# EAGLE design SparkFun_TransmogriShield (EAGLE 7.2.0)
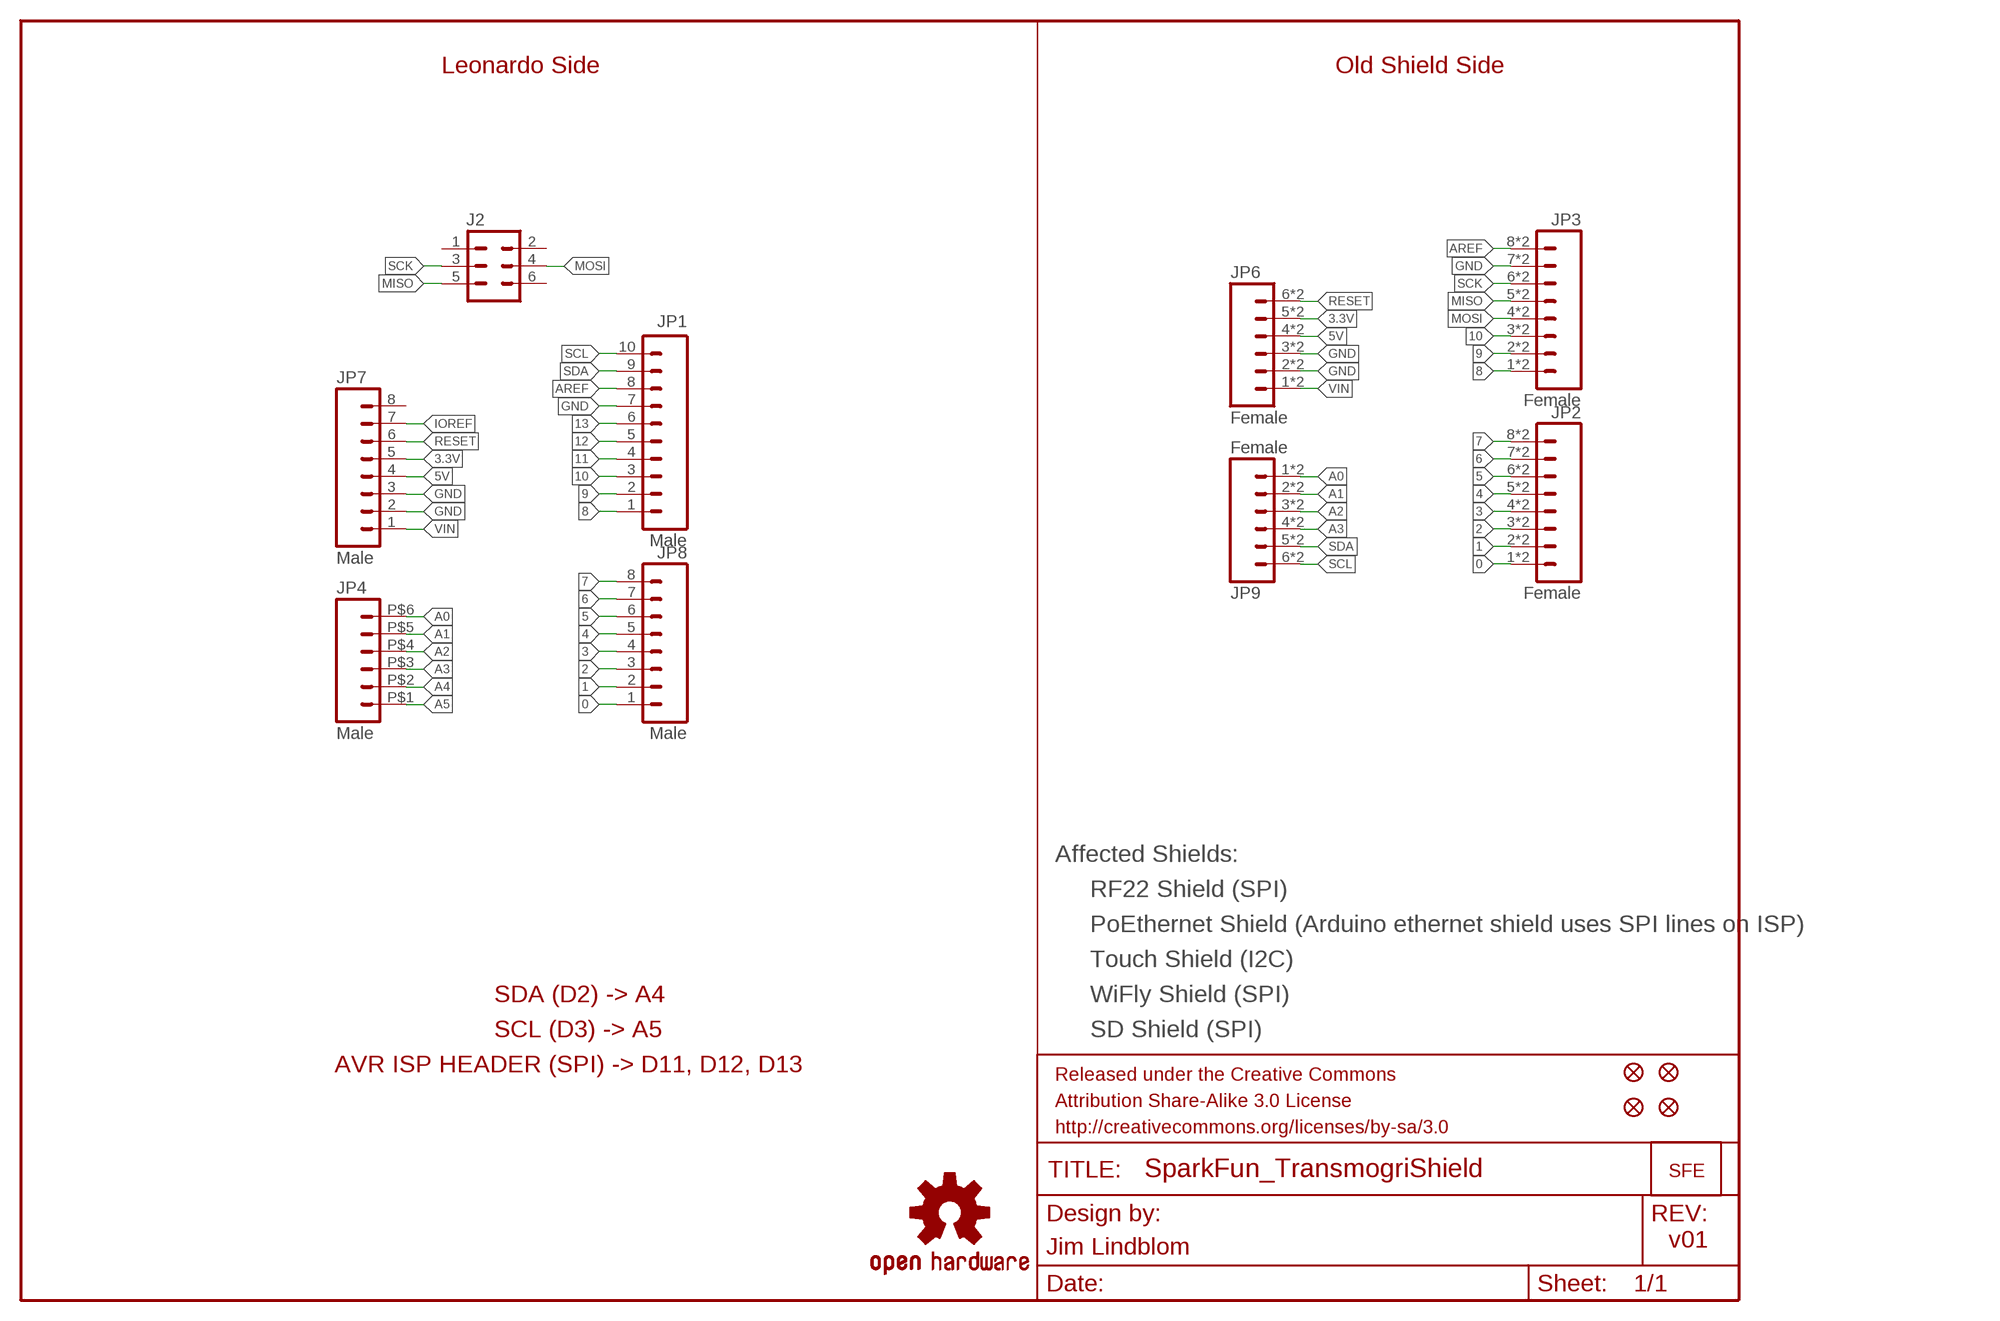
[diagram p0: schematic, sheet 1]

## Parts
J2  Female  M03X2  [2X3_SMD]
JP1  Male  M10SMD_MALE  [1X10_SMD_MALE]
JP2  Female  M08SMD-COMBO  [1X08_SMD_COMBINED]
JP3  Female  M08SMD-COMBO  [1X08_SMD_COMBINED]
JP4  Male  M06SMD_MALE  [1X06_SMD_MALE]
JP6  Female  M06SMD-STRAIGHT-COMBO  [1X06_SMD_STRAIGHT_COMBO]
JP7  Male  M08SMD-MALE  [1X08_SMD_MALE]
JP8  Male  M08SMD-MALE  [1X08_SMD_MALE]
JP9  Female  M06SMD-STRAIGHT-COMBO  [1X06_SMD_STRAIGHT_COMBO]
JP10  LOGO-SFESK  [SFE-LOGO-FLAME]
JP11  FIDUCIALUFIDUCIAL  [MICRO-FIDUCIAL]
JP12  FIDUCIALUFIDUCIAL  [MICRO-FIDUCIAL]
JP13  FIDUCIALUFIDUCIAL  [MICRO-FIDUCIAL]
JP14  FIDUCIALUFIDUCIAL  [MICRO-FIDUCIAL]
U$1  OSHW-LOGOS  [OSHW-LOGO-S]

## Nets
0: JP2.1 JP2.1@2 JP8.1
1: JP2.2 JP2.2@2 JP8.2
2: JP2.3 JP2.3@2 JP8.3
3: JP2.4 JP2.4@2 JP8.4
3.3V: JP6.5 JP6.5-2 JP7.5
4: JP2.5 JP2.5@2 JP8.5
5: JP2.6 JP2.6@2 JP8.6
5V: JP6.4 JP6.4-2 JP7.4
6: JP2.7 JP2.7@2 JP8.7
7: JP2.8 JP2.8@2 JP8.8
8: JP1.1 JP3.1 JP3.1@2
9: JP1.2 JP3.2 JP3.2@2
10: JP1.3 JP3.3 JP3.3@2
11: JP1.4
12: JP1.5
13: JP1.6
A0: JP4.P$6 JP9.1 JP9.1-2
A1: JP4.P$5 JP9.2 JP9.2-2
A2: JP4.P$4 JP9.3 JP9.3-2
A3: JP4.P$3 JP9.4 JP9.4-2
A4: JP4.P$2
A5: JP4.P$1
AREF: JP1.8 JP3.8 JP3.8@2
GND: JP1.7 JP3.7 JP3.7@2 JP6.2 JP6.2-2 JP6.3 JP6.3-2 JP7.2 JP7.3
IOREF: JP7.7
MISO: J2.5 JP3.5 JP3.5@2
MOSI: J2.4 JP3.4 JP3.4@2
RESET: JP6.6 JP6.6-2 JP7.6
SCK: J2.3 JP3.6 JP3.6@2
SCL: JP1.10 JP9.6 JP9.6-2
SDA: JP1.9 JP9.5 JP9.5-2
VIN: JP6.1 JP6.1-2 JP7.1
Unconnected: J2.1 J2.2 J2.6 JP7.8

## Notes on the sheet
- Leonardo Side | Old Shield Side
- Affected Shields:
- RF22 Shield (SPI)
- PoEthernet Shield (Arduino ethernet shield uses SPI lines on ISP)
- Touch Shield (I2C)
- SDA (D2) -> A4 | WiFly Shield (SPI)
- SCL (D3) -> A5 | SD Shield (SPI)
- AVR ISP HEADER (SPI) -> D11, D12, D13
- v01
- Jim Lindblom

## Library data of the parts
J2 = SparkFun-Connectors:M03X2
JP1 = SparkFun-Connectors:M10: Header 10 Standard 10-pin 0.1" header. Use with straight break away headers (SKU : PRT-00116), right angle break away headers (PRT-00553), swiss pins (PRT-00743), machine pins (PRT-00117), and female headers (PRT-00115).
JP2 JP3 JP7 JP8 = SparkFun-Connectors:M08: Header 8 Standard 8-pin 0.1" header. Use with straight break away headers (SKU : PRT-00116), right angle break away headers (PRT-00553), swiss pins (PRT-00743), machine pins (PRT-00117), and female headers (PRT-00115).
JP4 JP6 JP9 = SparkFun-Connectors:M06: Header 6 Standard 6-pin 0.1" header. Use with straight break away headers (SKU : PRT-00116), right angle break away headers (PRT-00553), swiss pins (PRT-00743), machine pins (PRT-00117), and female headers (PRT-00115). Molex polarized connector foot print use with SKU : PRT-08094 with associated crimp pins and housings. NOTES ON THE VARIANTS LOCK and LOCK_LONGPADS... This footprint was designed to help hold the alignment of a through-hole component (i.e. 6-pin header) while soldering it into place. You may notice that each hole has been shifted either up or down by 0.005 of an inch from it's more standard position (which is a perfectly straight line). This slight alteration caused the pins (the squares in the middle) to touch the edges of the holes. Because they are alternating, it causes a "brace" to hold the component in place. 0.005 has proven to be the perfect amount of "off-center" position when using our standard breakaway headers. Although looks a little odd when you look at the bare footprint, once you have a header in there, the alteration is very hard to notice. Also, if you push a header all the way into place, it is covered up entirely on the bottom side. This idea of altering the position of holes to aid alignment will be further integrated into the Sparkfun Library for other footprints. It can help hold any component with 3 or more connection pins.
JP10 = SparkFun-Aesthetics:LOGO-SFE: Spark Fun Electronics PCB Logo This is the standard Spark Fun Electronics PCB logo.
JP11-JP14 = SparkFun:FIDUCIAL: Fiducial Alignment Points Various fiducial points for machine vision alignment.
U$1 = SparkFun-Aesthetics:OSHW-LOGO: Open Source Hardware Logo This logo indicates the piece of hardware it is found on incorporates a OSHW license and/or adheres to the definition of open source hardware found here: http://freedomdefined.org/OSHW

## Board
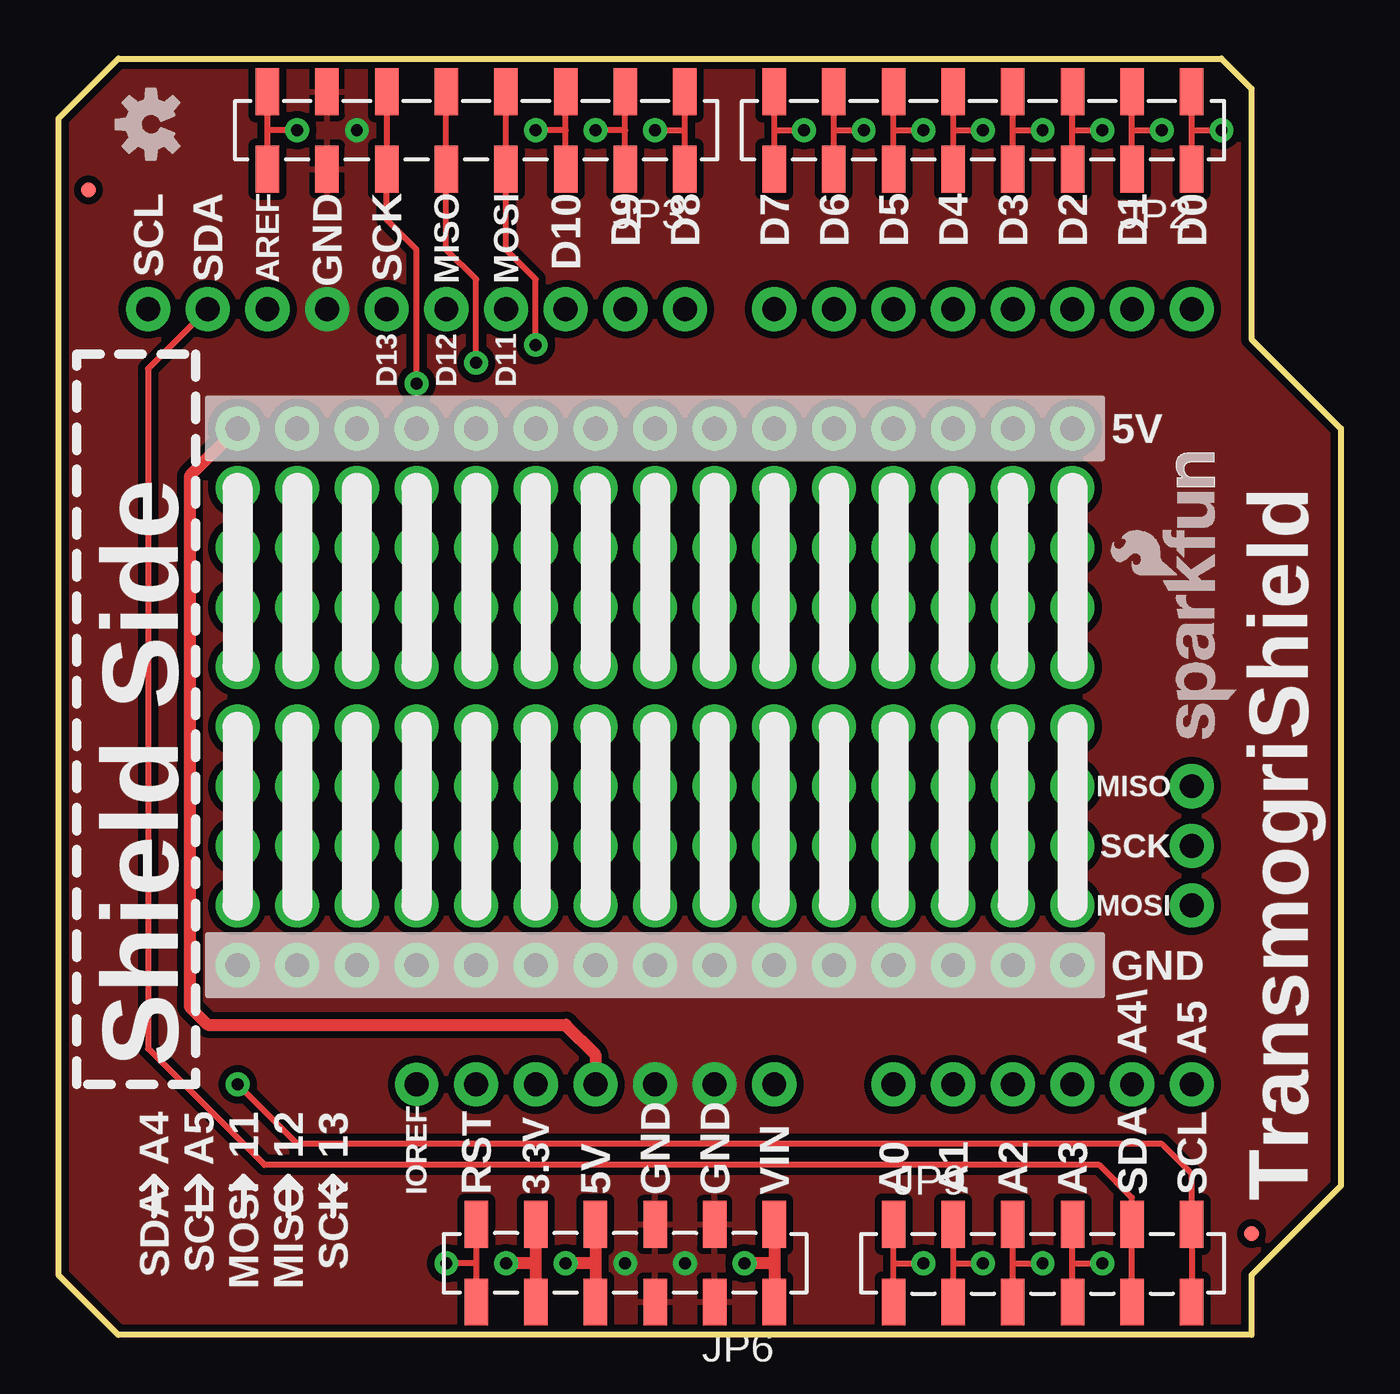
[diagram p1: board, top side]
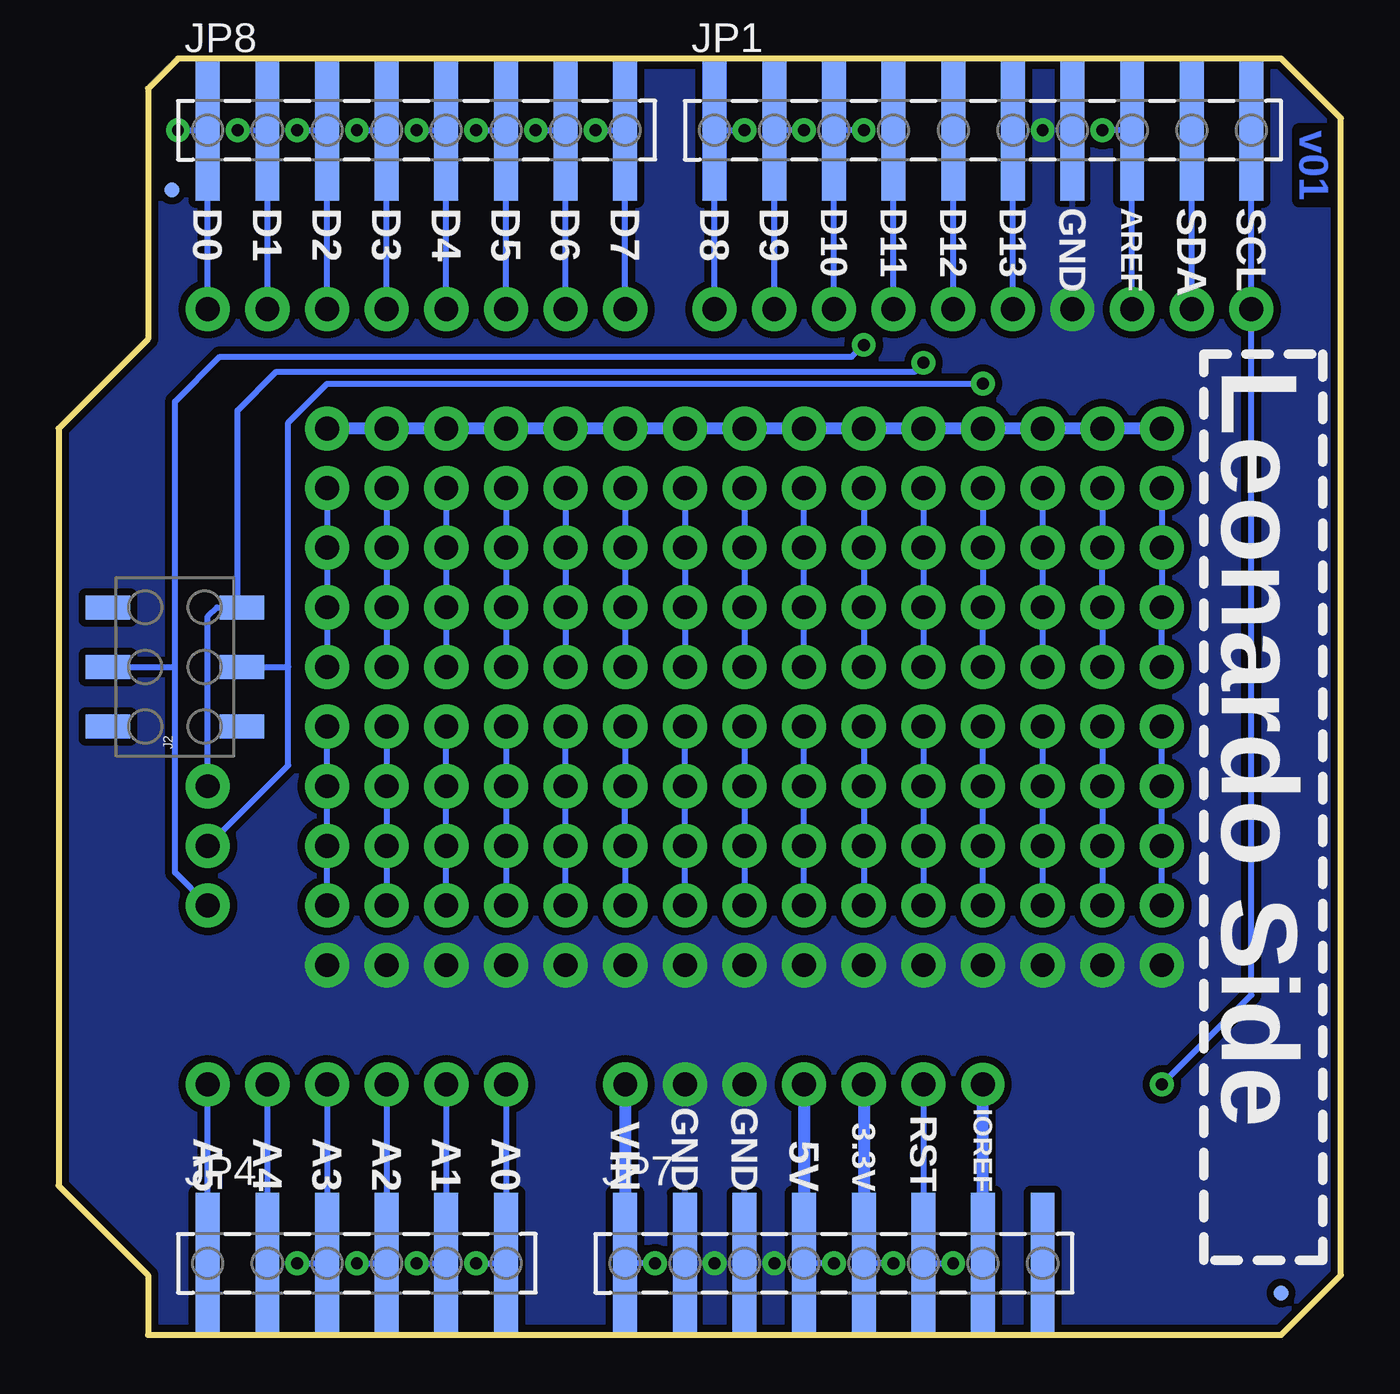
[diagram p2: board, bottom side, seen from below]

Size 54.61 x 54.36 mm. Coordinates in mm from the lower left corner, seen from the top.
Outline: 2.54,0 0,2.54 0,51.82 2.54,54.36 49.53,54.36 50.8,53.09 50.8,42.42 54.61,38.61 54.61,6.35 50.8,2.54 50.8,0 2.54,0
Copper layers (1*16): Top 0.035mm / dielectric 1.5mm / Bottom 0.035mm
Design rules "default": minimum track width 8mil, minimum drill 20mil, track to track 8mil, track to pad 8mil, pad to pad 8mil, via to via 8mil, smd to smd 8mil, copper to edge 8mil, drill to drill 8mil, minimum pad ring 12mil, minimum via ring 10mil, stop-mask expansion 4mil, vias tented up to drill 20mil, thermal gap 10mil

### Footprints (pad centres in the part's own frame; a part is rotated, then mirrored left to right if it is on the bottom)
2X3_SMD = smd 1.02 x 1.9: 1 -2.54,-2.85; 2 -2.54,2.85; 3 0,-2.85; 4 0,2.85; 5 2.54,-2.85; 6 2.54,2.85
1X10_SMD_MALE = smd 1.02 x 6: 1 0,0; 2 2.54,0; 3 5.08,0; 4 7.62,0; 5 10.16,0; 6 12.7,0; 7 15.24,0; 8 17.78,0; 9 20.32,0; 10 22.86,0
1X08_SMD_COMBINED = smd 1 x 2: 1 0,1.65; 1@2 0,-1.65; 2 2.54,-1.65; 2@2 2.54,1.65; 3 5.08,1.65; 3@2 5.08,-1.65; 4 7.62,-1.65; 4@2 7.62,1.65; 5 10.16,1.65; 5@2 10.16,-1.65; 6 12.7,-1.65; 6@2 12.7,1.65; 7 15.24,1.65; 7@2 15.24,-1.65; 8 17.78,-1.65; 8@2 17.78,1.65
1X06_SMD_MALE = smd 1.02 x 6: P$1 0,0; P$2 2.54,0; P$3 5.08,0; P$4 7.62,0; P$5 10.16,0; P$6 12.7,0
1X06_SMD_STRAIGHT_COMBO = smd 1 x 2: 1 0,-1.65; 1-2 0,1.65; 2 2.54,1.65; 2-2 2.54,-1.65; 3 5.08,-1.65; 3-2 5.08,1.65; 4 7.62,1.65; 4-2 7.62,-1.65; 5 10.16,-1.65; 5-2 10.16,1.65; 6 12.7,1.65; 6-2 12.7,-1.65
1X08_SMD_MALE = smd 1.02 x 6: 1 0,0; 2 2.54,0; 3 5.08,0; 4 7.62,0; 5 10.16,0; 6 12.7,0; 7 15.24,0; 8 17.78,0
MICRO-FIDUCIAL = smd 0.635 x 0.635: 1 0,0

### Placement (x,y rotation side)
J2  49.66,28.45 90 bottom
JP1  26.67,51.31 0 bottom
JP2  48.26,51.31 180 top
JP3  26.67,51.31 180 top
JP4  48.26,3.05 0 bottom
JP5  LOGO-SFENW2  [SFE-NEW-WEB]  50.16,25.4 90 top
JP6  30.48,3.05 180 top
JP7  30.48,3.05 0 bottom
JP8  48.26,51.31 0 bottom
JP9  35.56,3.05 0 top
JP10  47.62,32.38 90 top
JP11  50.8,4.32 0 top
JP12  1.27,48.77 0 top
JP13  2.54,1.78 0 bottom
JP14  49.78,48.77 0 bottom
U$1  3.94,51.56 90 top

### Tracks (layer width: path | path; a pad name or v marks a point on that pad's centre or on a via)
0  (via drill 0.51, 1.02 pad 1.88)
  Top 0.254: JP2.1 JP8.1 | JP8.1 JP2.1@2 | JP8.1 v49.53,51.31
  Bottom 0.254: v48.26,43.69 JP8.1 v49.53,51.31
1  (via drill 0.51, 1.02 pad 1.88)
  Top 0.254: JP2.2@2 JP8.2 | JP8.2 JP2.2 | JP8.2 v46.99,51.31
  Bottom 0.254: v45.72,43.69 JP8.2 v46.99,51.31
2  (via drill 0.51, 1.02 pad 1.88)
  Top 0.254: JP2.3 JP8.3 | JP8.3 JP2.3@2 | JP8.3 v44.45,51.31
  Bottom 0.254: v43.18,43.69 JP8.3 v44.45,51.31
3  (via drill 0.51, 1.02 pad 1.88)
  Top 0.254: JP2.4@2 JP8.4 | JP8.4 JP2.4 | JP8.4 v41.91,51.31
  Bottom 0.254: v40.64,43.69 JP8.4 v41.91,51.31
3.3V  (via drill 0.51, 1.02 pad 1.88)
  Top 0.508: JP6.5 JP7.5 | JP7.5 JP6.5-2 | JP7.5 v19.05,3.05
  Bottom 0.254: v19.05,3.05 JP7.5
  Bottom 0.508: v20.32,10.67 JP7.5
4  (via drill 0.51, 1.02 pad 1.88)
  Top 0.254: JP2.5 JP8.5 | JP8.5 JP2.5@2 | JP8.5 v39.37,51.31
  Bottom 0.254: v38.1,43.69 JP8.5 v39.37,51.31
5  (via drill 0.51, 1.02 pad 1.88)
  Top 0.254: JP2.6@2 JP8.6 | JP8.6 JP2.6 | JP8.6 v36.83,51.31
  Bottom 0.254: v35.56,43.69 JP8.6 v36.83,51.31
5V  (via drill 0.51, 1.02 pad 1.88)
  Top 0.508: v7.62,38.61 5.59,36.58 5.59,13.97 6.35,13.21 21.59,13.21 22.86,11.94 v22.86,10.67 | JP6.4-2 JP7.4 | JP7.4 JP6.4 | JP7.4 v21.59,3.05
  Bottom 0.254: v21.59,3.05 JP7.4
  Bottom 0.508: v7.62,38.61 v10.16,38.61 v12.7,38.61 v15.24,38.61 v17.78,38.61 v20.32,38.61 v22.86,38.61 v25.4,38.61 v27.94,38.61 v30.48,38.61 v33.02,38.61 v35.56,38.61 v38.1,38.61 v40.64,38.61 v43.18,38.61 | v22.86,10.67 JP7.4
6  (via drill 0.51, 1.02 pad 1.88)
  Top 0.254: JP2.7 JP8.7 | JP8.7 JP2.7@2 | JP8.7 v34.29,51.31
  Bottom 0.254: v33.02,43.69 JP8.7 v34.29,51.31
7  (via drill 0.51, 1.02 pad 1.88)
  Top 0.254: JP2.8@2 JP8.8 | JP8.8 JP2.8 | JP8.8 v31.75,51.31
  Bottom 0.254: v30.48,43.69 JP8.8 v31.75,51.31
8  (via drill 0.51, 1.02 pad 1.88)
  Top 0.254: JP3.1 JP1.1 | JP1.1 JP3.1@2 | v25.4,51.31 JP1.1
  Bottom 0.254: v26.67,43.69 JP1.1 v25.4,51.31
9  (via drill 0.51, 1.02 pad 1.88)
  Top 0.254: JP3.2@2 JP1.2 | JP1.2 JP3.2 | JP1.2 v22.86,51.31
  Bottom 0.254: v24.13,43.69 JP1.2 v22.86,51.31
10  (via drill 0.51, 1.02 pad 1.88)
  Top 0.254: JP3.3 JP1.3 | JP1.3 JP3.3@2 | JP1.3 v20.32,51.31
  Bottom 0.254: v21.59,43.69 JP1.3 v20.32,51.31
11  (via drill 1.02 pad 1.88)
  Bottom 0.254: v19.05,43.69 JP1.4
12  (via drill 1.02 pad 1.88)
  Bottom 0.254: v16.51,43.69 JP1.5
13  (via drill 1.02 pad 1.88)
  Bottom 0.254: v13.97,43.69 JP1.6
A0  (via drill 0.51, 1.02 pad 1.88)
  Top 0.254: JP9.1 JP4.P$6 | JP4.P$6 JP9.1-2 | JP4.P$6 v36.83,3.05
  Bottom 0.254: v36.83,3.05 JP4.P$6 v35.56,10.67
A1  (via drill 0.51, 1.02 pad 1.88)
  Top 0.254: JP9.2-2 JP4.P$5 | JP4.P$5 JP9.2 | JP4.P$5 v39.37,3.05
  Bottom 0.254: v39.37,3.05 JP4.P$5 v38.1,10.67
A2  (via drill 0.51, 1.02 pad 1.88)
  Top 0.254: JP9.3 JP4.P$4 | JP4.P$4 JP9.3-2 | JP4.P$4 v41.91,3.05
  Bottom 0.254: v41.91,3.05 JP4.P$4 v40.64,10.67
A3  (via drill 0.51, 1.02 pad 1.88)
  Top 0.254: JP9.4-2 JP4.P$3 | JP4.P$3 JP9.4 | JP4.P$3 v44.45,3.05
  Bottom 0.254: v44.45,3.05 JP4.P$3 v43.18,10.67
A4  (via drill 1.02 pad 1.88)
  Bottom 0.254: 45.72,1.4 JP4.P$2 v45.72,10.67
A5  (via drill 1.02 pad 1.88)
  Bottom 0.254: JP4.P$1 v48.26,10.67
AREF  (via drill 0.51, 1.02 pad 1.88)
  Top 0.254: JP3.8@2 JP1.8 | JP1.8 JP3.8 | v10.16,51.31 JP1.8
  Bottom 0.254: v8.89,43.69 JP1.8 v10.16,51.31
GND  (via drill 0.51, 1.02 pad 1.88)
  other vias: 24.13,3.05 12.7,51.31 26.67,3.05 11.43,43.69 7.62,15.75 10.16,15.75 12.7,15.75 15.24,15.75 17.78,15.75 20.32,15.75 22.86,15.75 25.4,15.75 27.94,15.75 30.48,15.75 35.56,15.75 33.02,15.75 38.1,15.75 40.64,15.75 43.18,15.75 25.4,10.67 27.94,10.67
  pour Top (isolate 0.305): 0,55.12 0,-0.76 54.61,-0.76 54.61,55.12
  pour Bottom (isolate 0.305): 0,55.12 0,-0.76 54.61,-0.76 54.61,55.12
IOREF  (via drill 1.02 pad 1.83)
  Bottom 0.254: JP7.7 15.24,1.4
  Bottom 0.508: JP7.7 v15.24,10.67
MISO  (via drill 0.51, 1.02 pad 1.88)
  Top 0.254: JP3.5@2 JP3.5 16.51,46.23 17.78,44.96 v17.78,41.4
  Bottom 0.254: v17.78,41.4 18.16,41.02 45.34,41.02 46.99,39.37 46.99,31.17 J2.5 47.88,30.99 48.26,30.61 v48.26,23.37
MOSI  (via drill 0.51, 1.02 pad 1.88)
  Top 0.254: JP3.4 JP3.4@2 19.05,46.23 20.32,44.96 v20.32,42.16
  Bottom 0.254: J2.4 49.66,28.45 | 49.66,28.45 49.66,19.68 v48.26,18.29 | 49.66,28.45 49.66,39.75 47.75,41.66 20.83,41.66 v20.32,42.16
N$1  (via drill 1.02 pad 1.88)
  Bottom 0.254: v7.62,18.29 v7.62,20.83 v7.62,23.37 v7.62,25.91
N$2  (via drill 1.02 pad 1.88)
  Bottom 0.254: v10.16,25.91 v10.16,23.37 v10.16,20.83 v10.16,18.29
N$3  (via drill 1.02 pad 1.88)
  Bottom 0.254: v12.7,18.29 v12.7,20.83 v12.7,23.37 v12.7,25.91
N$4  (via drill 1.02 pad 1.88)
  Bottom 0.254: v15.24,18.29 v15.24,20.83 v15.24,23.37 v15.24,25.91
N$5  (via drill 1.02 pad 1.88)
  Bottom 0.254: v17.78,25.91 v17.78,23.37 v17.78,20.83 v17.78,18.29
N$6  (via drill 1.02 pad 1.88)
  Bottom 0.254: v20.32,25.91 v20.32,23.37 v20.32,20.83 v20.32,18.29
N$7  (via drill 1.02 pad 1.88)
  Bottom 0.254: v22.86,18.29 v22.86,20.83 v22.86,23.37 v22.86,25.91
N$8  (via drill 1.02 pad 1.88)
  Bottom 0.254: v25.4,25.91 v25.4,23.37 v25.4,20.83 v25.4,18.29
N$9  (via drill 1.02 pad 1.88)
  Bottom 0.254: v27.94,18.29 v27.94,20.83 v27.94,23.37 v27.94,25.91
N$10  (via drill 1.02 pad 1.88)
  Bottom 0.254: v30.48,25.91 v30.48,23.37 v30.48,20.83 v30.48,18.29
N$11  (via drill 1.02 pad 1.88)
  Bottom 0.254: v33.02,18.29 v33.02,20.83 v33.02,23.37 v33.02,25.91
N$12  (via drill 1.02 pad 1.88)
  Bottom 0.254: v35.56,25.91 v35.56,23.37 v35.56,20.83 v35.56,18.29
N$13  (via drill 1.02 pad 1.88)
  Bottom 0.254: v38.1,18.29 v38.1,20.83 v38.1,23.37 v38.1,25.91
N$14  (via drill 1.02 pad 1.88)
  Bottom 0.254: v40.64,25.91 v40.64,23.37 v40.64,20.83 v40.64,18.29
N$15  (via drill 1.02 pad 1.88)
  Bottom 0.254: v43.18,18.29 v43.18,20.83 v43.18,23.37 v43.18,25.91
N$19  (via drill 1.02 pad 1.88)
  Bottom 0.254: v40.64,36.07 v40.64,33.53 v40.64,30.99 v40.64,28.45
N$68  (via drill 1.02 pad 1.88)
  Bottom 0.254: v38.1,36.07 v38.1,33.53 v38.1,30.99 v38.1,28.45
N$101  (via drill 1.02 pad 1.88)
  Bottom 0.254: v15.24,36.07 v15.24,33.53 v15.24,30.99 v15.24,28.45
N$102  (via drill 1.02 pad 1.88)
  Bottom 0.254: v17.78,28.45 v17.78,30.99 v17.78,33.53 v17.78,36.07
N$103  (via drill 1.02 pad 1.88)
  Bottom 0.254: v20.32,36.07 v20.32,33.53 v20.32,30.99 v20.32,28.45
N$104  (via drill 1.02 pad 1.88)
  Bottom 0.254: v22.86,28.45 v22.86,30.99 v22.86,33.53 v22.86,36.07
N$105  (via drill 1.02 pad 1.88)
  Bottom 0.254: v25.4,36.07 v25.4,33.53 v25.4,30.99 v25.4,28.45
N$106  (via drill 1.02 pad 1.88)
  Bottom 0.254: v27.94,28.45 v27.94,30.99 v27.94,33.53 v27.94,36.07
N$107  (via drill 1.02 pad 1.88)
  Bottom 0.254: v30.48,36.07 v30.48,33.53 v30.48,30.99 v30.48,28.45
N$108  (via drill 1.02 pad 1.88)
  Bottom 0.254: v33.02,36.07 v33.02,33.53 v33.02,30.99 v33.02,28.45
N$109  (via drill 1.02 pad 1.88)
  Bottom 0.254: v35.56,36.07 v35.56,33.53 v35.56,30.99 v35.56,28.45
N$206  (via drill 1.02 pad 1.88)
  Bottom 0.254: v43.18,36.07 v43.18,33.53 v43.18,30.99 v43.18,28.45
NET1  (via drill 1.02 pad 1.88)
  Bottom 0.254: v7.62,36.07 v7.62,33.53 v7.62,30.99 v7.62,28.45
NET2  (via drill 1.02 pad 1.88)
  Bottom 0.254: v10.16,36.07 v10.16,33.53 v10.16,30.99 v10.16,28.45
NET3  (via drill 1.02 pad 1.88)
  Bottom 0.254: v12.7,28.45 v12.7,30.99 v12.7,33.53 v12.7,36.07
RESET  (via drill 0.51, 1.02 pad 1.88)
  Top 0.254: JP6.6-2 JP7.6 | JP7.6 JP6.6 | JP7.6 v16.51,3.05
  Bottom 0.254: v17.78,10.67 JP7.6 v16.51,3.05
SCK  (via drill 0.51, 1.02 pad 1.88)
  Top 0.254: JP3.6 JP3.6@2 13.97,47.5 15.24,46.23 v15.24,40.51
  Bottom 0.254: 44.83,28.45 44.83,24.26 v48.26,20.83 | 44.83,28.45 44.83,38.86 43.18,40.51 v15.24,40.51 | J2.3 44.83,28.45
SCL  (via drill 0.51, 1.02 pad 1.88)
  Top 0.254: JP9.6-2 JP9.6 48.26,6.86 46.99,8.13 10.16,8.13 v7.62,10.67
  Bottom 0.254: v7.62,10.67 3.81,14.48 v3.81,43.69 JP1.10
SDA  (via drill 1.02 pad 1.88)
  Top 0.254: JP9.5 JP9.5-2 45.72,5.84 44.32,7.24 8.76,7.24 3.81,12.19 3.81,41.15 v6.35,43.69
  Bottom 0.254: v6.35,43.69 JP1.9
VIN  (via drill 0.51, 1.02 pad 1.88)
  Top 0.508: JP6.1 JP7.1 | JP7.1 JP6.1-2 | JP7.1 v29.21,3.05
  Bottom 0.254: v29.21,3.05 JP7.1
  Bottom 0.508: v30.48,10.67 JP7.1

### Text on the board
Bottom: v01
tPlace: SCL | SDA | AREF | GND | SCK | MISO | MOSI | D10 | D9 | D8 | D7 | D6 | D5 | D4 | D3 | D2 | D1 | D0 | D13 | D12 | D11 | 5V | MISO | SCK | MOSI | GND | Shield Side | A4\ | A5 | SDA A4 | SCL A5 | MOSI 11 | MISO 12 | SCK 13 | IOREF | RST | 3.3V | 5V | GND | GND | VIN | A0 | A1 | A2 | A3 | SDA | SCL | TransmogriShield
bPlace: SCL | SDA | AREF | GND | D13 | D12 | D11 | D10 | D9 | D8 | D7 | D6 | D5 | D4 | D3 | D2 | D1 | D0 | Leonardo Side | IOREF | RST | 3.3V | 5V | GND | GND | VIN | A0 | A1 | A2 | A3 | A4 | A5